# Altium schematic sheet Toffee.SchDoc
size A
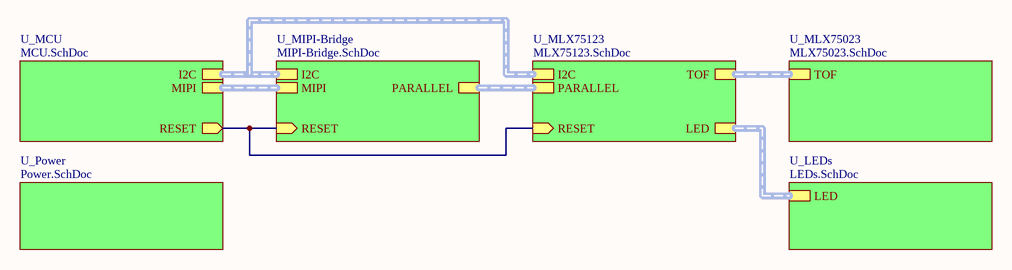
[diagram p0: Toffee.SchDoc]

## Sub-sheets
U_LEDs = LEDs.SchDoc: LED (harness LED)
U_MCU = MCU.SchDoc: I2C (harness I2C), MIPI (harness MIPI), RESET (out)
U_MIPI-Bridge = MIPI-Bridge.SchDoc: I2C (harness I2C), PARALLEL (harness Parallel), MIPI (harness MIPI), RESET (in)
U_MLX75023 = MLX75023.SchDoc: TOF (harness TOF)
U_MLX75123 = MLX75123.SchDoc: PARALLEL (harness Parallel), I2C (harness I2C), TOF (harness TOF), LED (harness LED), RESET (in)
U_Power = Power.SchDoc: no entries

## Nets
(unnamed): sheet U_MCU/RESET, sheet U_MIPI-Bridge/RESET, sheet U_MLX75123/RESET

## Buses and harness runs
harness sheet U_LEDs/LED = sheet U_MLX75123/LED
harness sheet U_MCU/I2C = sheet U_MIPI-Bridge/I2C = sheet U_MLX75123/I2C
harness sheet U_MCU/MIPI = sheet U_MIPI-Bridge/MIPI
harness sheet U_MIPI-Bridge/PARALLEL = sheet U_MLX75123/PARALLEL
harness sheet U_MLX75023/TOF = sheet U_MLX75123/TOF